# EasyEDA schematic EasyEDAการออกแบบวงจรรถขับอัตโนมัติ.json
TITLE: Sheet_1; REV: 1.0; Date: 2022-02-25; Sheet: 1/1; Company: Your Company
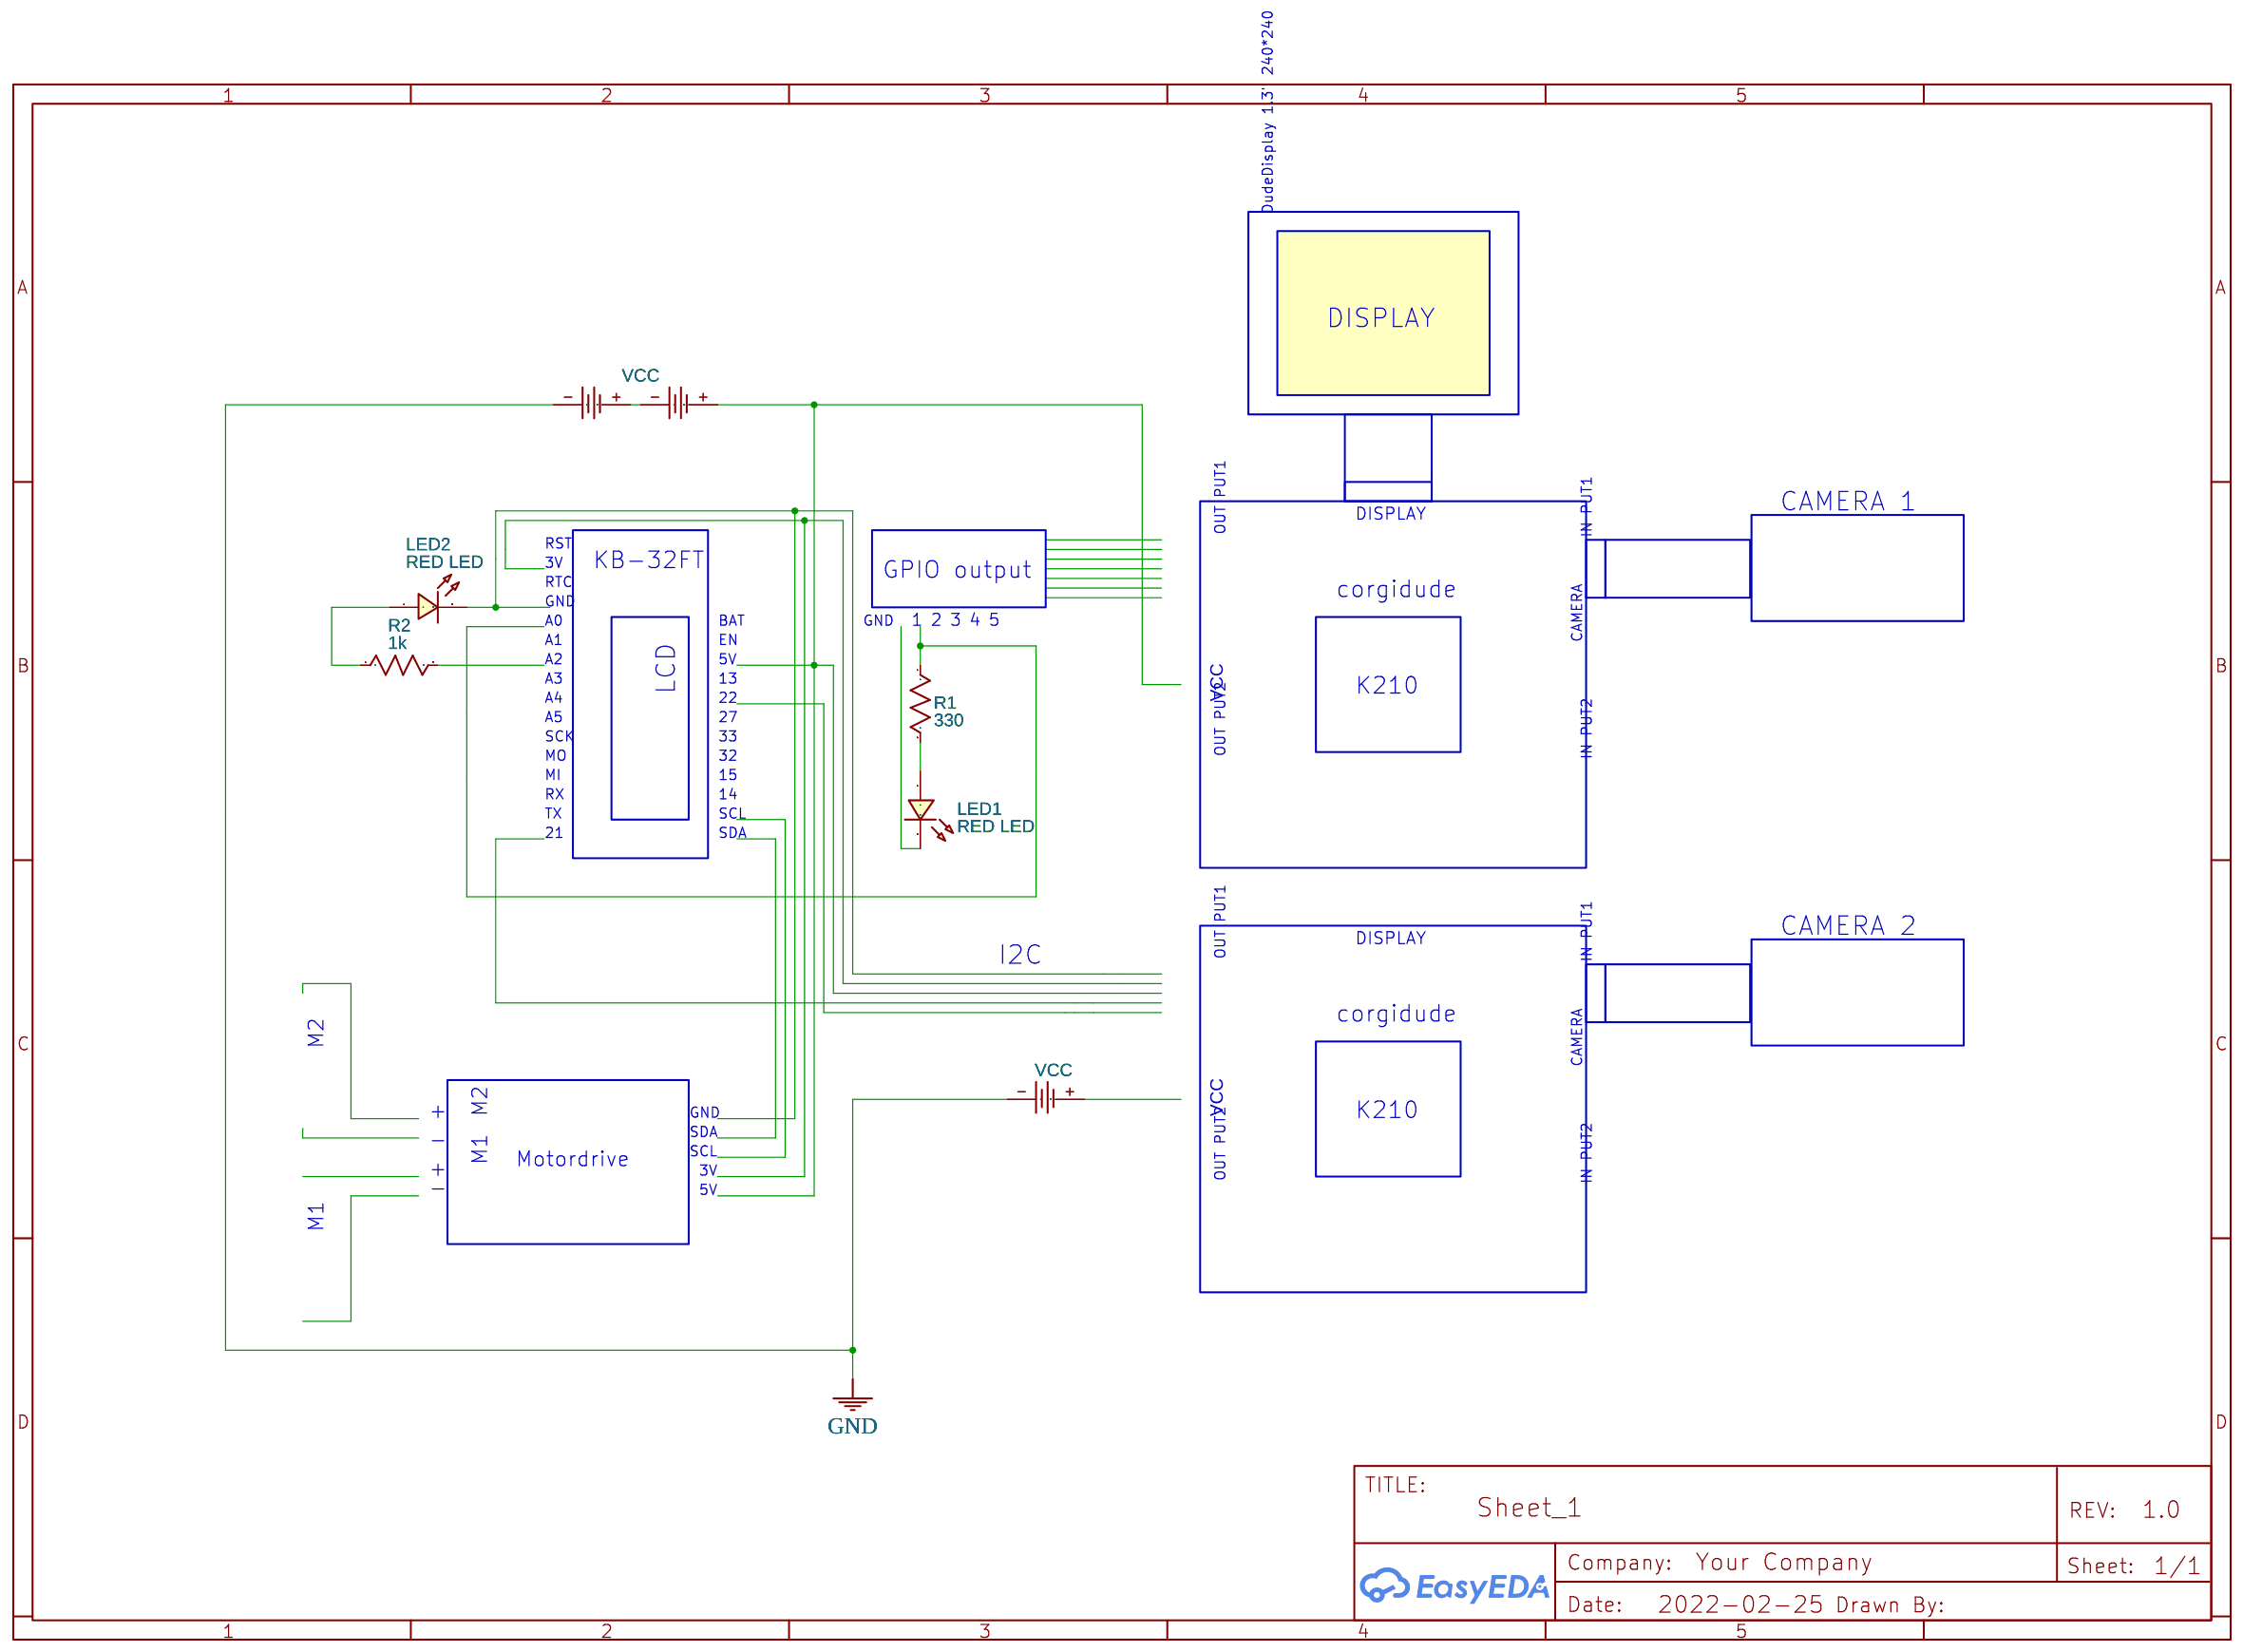
[diagram p0: schematic sheet]

## Parts
B1  VCC  [BAT-SMD_CR1220-2]
LED1  RED LED  [LED0603_RED]
LED2  RED LED  [LED0603_RED]
R1  330  [R0603]
R2  1k  [R0603]
V  CR1220-2  [BAT-SMD_CR1220-2]
VCC  CR1220-2  [BAT-SMD_CR1220-2]

## Library data of the parts
B1 V VCC = CR1220-2: Supplier: LCSC; Manufacturer: Q&J; image: //image.lceda.cn/szlcsc/C70381.jpg; Supplier Part: C70381
LED1 LED2 = LED-0603_R: Manufacturer: EVERLIGHT(台湾亿光); Manufacturer Part: 19-217/R6C-AL1M2VY/3T; Supplier Part: C72044; Supplier: LCSC; Contributor: LCEDA_01
R1 R2 = R_0603_US: Contributor: LCEDA_Lib

## Nets
GND: B1.-(1) VCC.-(1)
Net-(B1-+): B1.+(2) V.-(1)
Net-(LED1-1): LED1.1 R1.2
Net-(LED2-1): LED2.1 R2.1

Not connected (* = marked no-connect by the designer): LED1 2; LED2 2; R1 1; R2 2; V +(2); VCC +(2)

## Notes on the sheet
- DudeDisplay 1.3" 240*240
- DISPLAY
- CAMERA 1
- DISPLAY
- RST
- KB-32FT
- OUT PUT1
- IN PUT1
- 3V
- GPIO output
- GND
- RTC
- corgidude
- A0
- BAT
- GND
- 1
- 2
- 3
- 4
- 5
- A1
- EN
- CAMERA
- A2
- 5V
- A3
- 13
- K210
- A4
- A5
- LCD
- 22
- 27
- VCC
- SCK
- 33
- MO
- 32
- MI
- 15
- OUT PUT2
- IN PUT2
- RX
- 14
- TX
- SCL
- 21
- SDA
- CAMERA 2
- DISPLAY
- I2C
- OUT PUT1
- IN PUT1
- corgidude
- M2
- CAMERA
- +
- M2
- GND
- VCC
- K210
- -
- SDA
- +
- M1
- Motordrive
- SCL
- 3V
- -
- 5V
- OUT PUT2
- IN PUT2
- M1
